# EAGLE design darlington array (EAGLE 9.3.0)
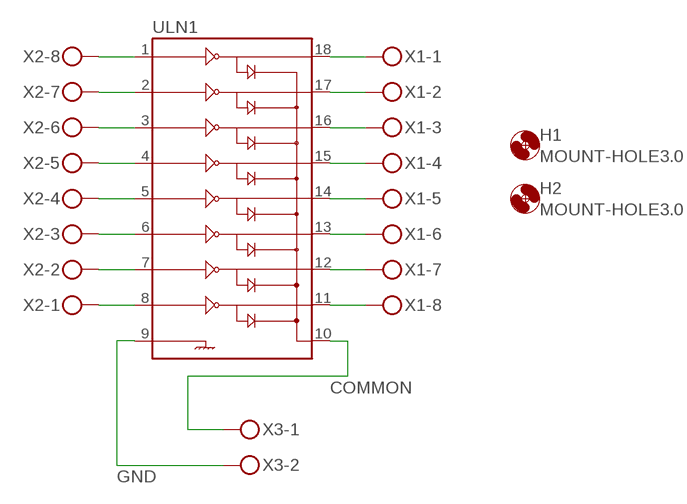
[diagram p0: schematic, sheet 1]

## Parts
H1  MOUNT-HOLE3.0  [3,0]
H2  MOUNT-HOLE3.0  [3,0]
ULN1  ULN2803DIP  [DIL18]
X1  MKDSN1,5/8-5,08  [MKDSN1,5/8-5,08]
X2  MKDSN1,5/8-5,08  [MKDSN1,5/8-5,08]
X3  MKDSN1,5/2-5,08  [MKDSN1,5/2-5,08]

## Nets
COMMON: ULN1.10 X3.1
GND: ULN1.9 X3.2
N$1: ULN1.1 X2.8
N$2: ULN1.2 X2.7
N$3: ULN1.3 X2.6
N$4: ULN1.4 X2.5
N$5: ULN1.5 X2.4
N$6: ULN1.6 X2.3
N$7: ULN1.7 X2.2
N$8: ULN1.8 X2.1
N$9: ULN1.18 X1.1
N$10: ULN1.17 X1.2
N$11: ULN1.16 X1.3
N$12: ULN1.15 X1.4
N$13: ULN1.14 X1.5
N$14: ULN1.13 X1.6
N$15: ULN1.12 X1.7
N$16: ULN1.11 X1.8

## Library data of the parts
H1 H2 = holes:MOUNT-HOLE: MOUNTING HOLE with drill center marker
ULN1 = SparkFun-IC-Special-Function:ULN2803: Darlington Driver(IC-07959, low stock) ULN2803 Darlington array. 500mA max per channel, 8-channel package. Spark Fun Electronics SKU : COM-00312
X1 X2 = con-phoenix-508:MKDSN1,5/8-5,08: MKDSN 1,5/ 8-5,08 Printklemme Nennstrom: 13,5 A Nennspannung: 250 V Rastermaß: 5,08 mm Polzahl: 8 Anschlussart: Schraubanschluss Montage: Löten Anschlussrichtung Leiter/Platine: 0 ° Artikelnummer: 1729186 Source: http://eshop.phoenixcontact.com .. 1729186.pdf
X3 = con-phoenix-508:MKDSN1,5/2-5,08: MKDSN 1,5/ 2-5,08 Printklemme Nennstrom: 13,5 A Nennspannung: 250 V Rastermaß: 5,08 mm Polzahl: 2 Anschlussart: Schraubanschluss Montage: Löten Anschlussrichtung Leiter/Platine: 0 ° Artikelnummer: 1729128 Source: http://eshop.phoenixcontact.com .. 1729128.pdf

## Board
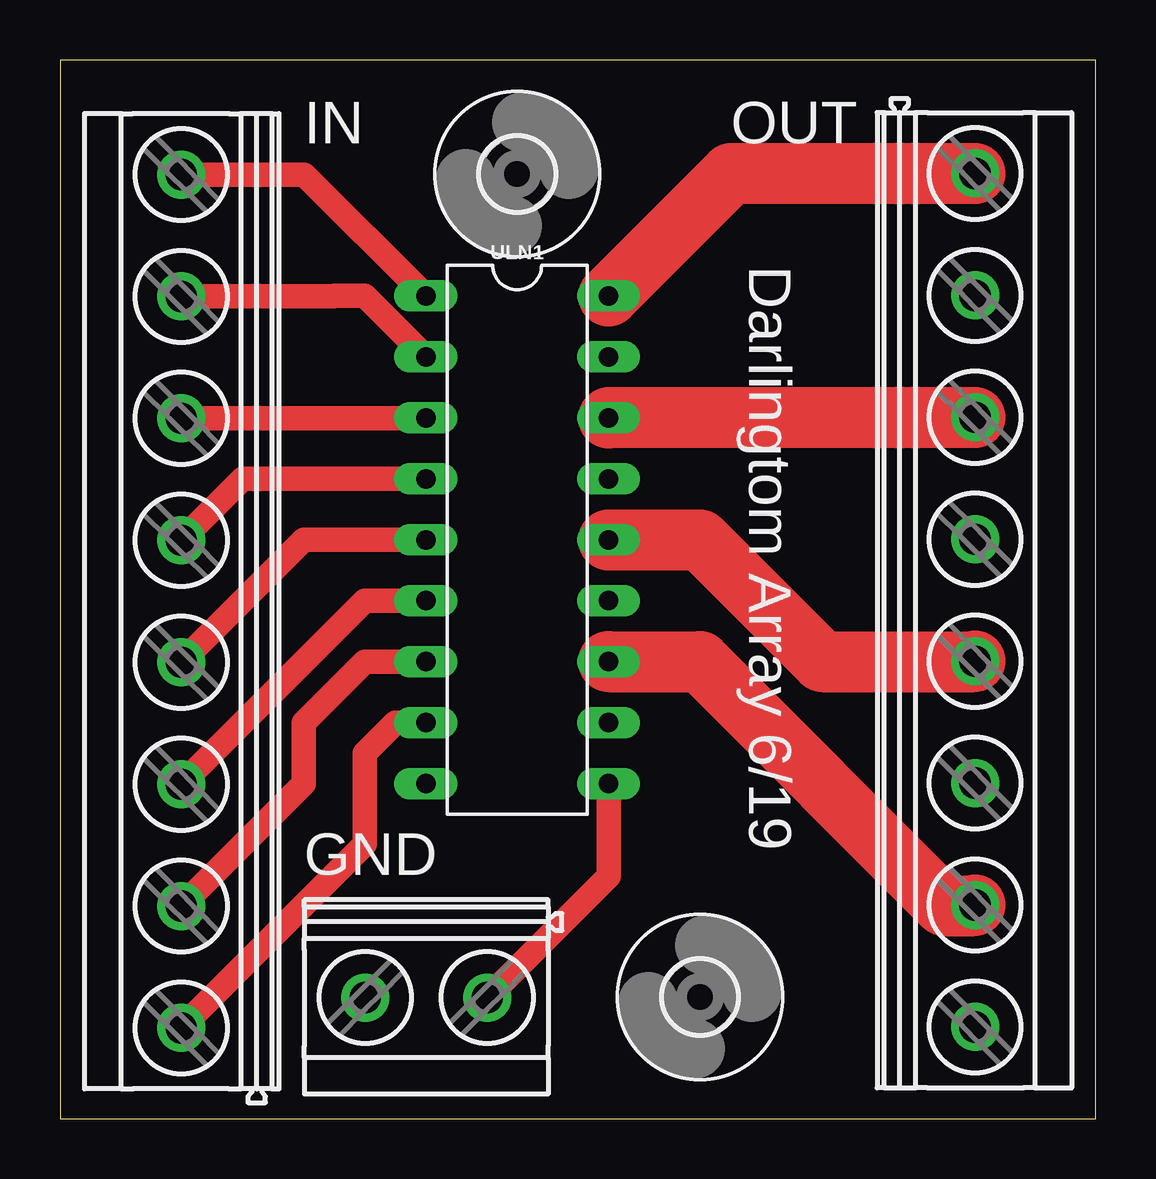
[diagram p1: board, top side]
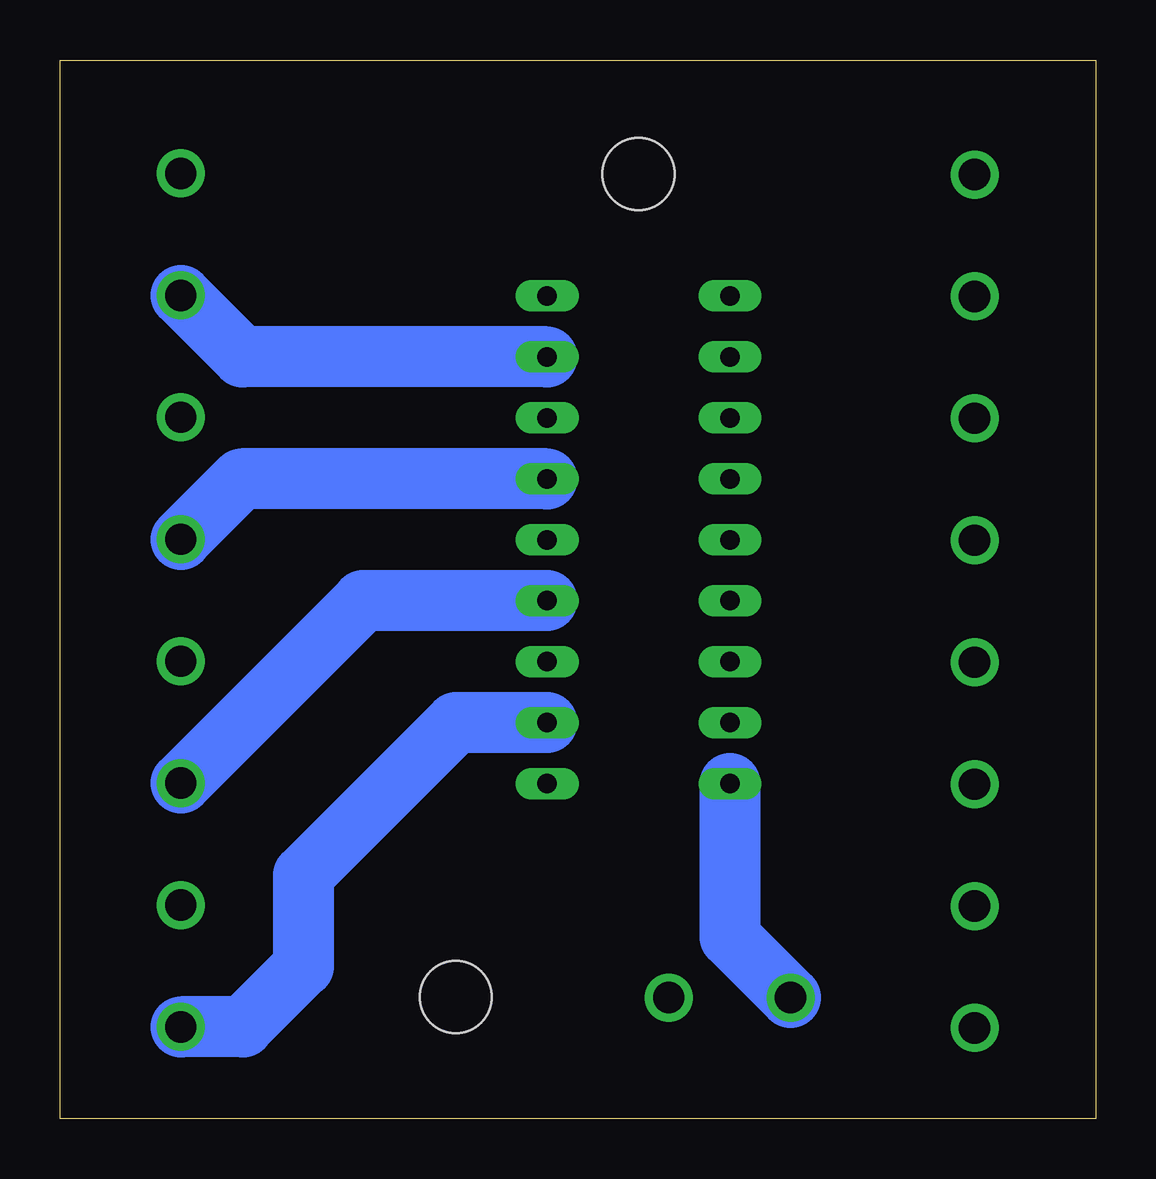
[diagram p2: board, bottom side, seen from below]

Size 43.16 x 44.12 mm. Coordinates in mm from the lower left corner, seen from the top.
Outline: 0,0 43.16,0 43.16,44.12 0,44.12 0,0
Copper layers (1*16): Top 0.035mm / dielectric 1.5mm / Bottom 0.035mm
Design rules "default": minimum track width 6mil, minimum drill 0.35mm, track to track 6mil, track to pad 6mil, pad to pad 6mil, via to via 6mil, smd to smd 6mil, copper to edge 40mil, drill to drill 6mil, minimum pad ring 10mil, minimum via ring 8mil, stop-mask expansion 4mil, vias tented up to drill 0mil, thermal gap 10mil

### Footprints (pad centres in the part's own frame; a part is rotated, then mirrored left to right if it is on the bottom)
3,0 = hole 3: 0,0
DIL18 = drill 0.813 long: 1 -10.16,-3.81; 2 -7.62,-3.81; 3 -5.08,-3.81; 4 -2.54,-3.81; 5 0,-3.81; 6 2.54,-3.81; 7 5.08,-3.81; 8 7.62,-3.81; 9 10.16,-3.81; 10 10.16,3.81; 11 7.62,3.81; 12 5.08,3.81; 13 2.54,3.81; 14 0,3.81; 15 -2.54,3.81; 16 -5.08,3.81; 17 -7.62,3.81; 18 -10.16,3.81
MKDSN1,5/8-5,08 = drill 1.3 pad 2: 1 -17.801,0.025; 2 -12.721,0.025; 3 -7.641,0.025; 4 -2.561,0.025; 5 2.519,0.025; 6 7.599,0.025; 7 12.679,0.025; 8 17.759,0.025
MKDSN1,5/2-5,08 = drill 1.3 pad 2: 1 -2.561,0.025; 2 2.519,0.025

### Placement (x,y rotation side)
H1  19.05,39.37 0 top
H2  26.67,5.08 0 top
ULN1  19.05,24.13 270 top
X1  38.1,21.59 270 top
X2  5.08,21.59 90 top
X3  15.24,5.08 180 top

### Tracks (layer width: path | path; a pad name or v marks a point on that pad's centre or on a via)
COMMON
  Top 1.016: X3.1 22.86,10.11 ULN1.10
GND
  Bottom 2.54: X3.2 15.24,7.57 ULN1.9
N$1
  Top 1.016: X2.8 10.18,39.35 ULN1.1
N$2
  Top 1.016: X2.7 11.41,34.27 11.43,34.29 12.7,34.29 ULN1.2
N$3
  Top 1.016: X2.6 15.22,29.19 ULN1.3
N$4
  Top 1.016: X2.5 7.62,26.67 ULN1.4
N$5
  Top 1.016: X2.4 10.16,24.13 ULN1.5
N$6
  Top 1.016: X2.3 12.7,21.59 ULN1.6
N$7
  Top 1.016: X2.2 10.16,13.97 10.16,16.51 12.7,19.05 ULN1.7
N$8
  Top 1.016: X2.1 12.7,11.43 12.7,15.24 13.97,16.51 ULN1.8
N$9
  Top 2.54: ULN1.18 27.96,39.39 X1.1
N$10
  Bottom 2.54: ULN1.17 35.56,31.75 X1.2
N$11
  Top 2.54: ULN1.16 22.88,29.23 X1.3
N$12
  Bottom 2.54: ULN1.15 35.61,26.67 X1.4
N$13
  Top 2.54: ULN1.14 26.67,24.13 31.75,19.05 38.1,19.05 X1.5
N$14
  Bottom 2.54: ULN1.13 30.53,21.59 X1.6
N$15
  Top 2.54: ULN1.12 26.67,19.05 36.83,8.89 38.1,8.89 X1.7
N$16
  Bottom 2.54: ULN1.11 26.67,16.51 33.02,10.16 33.02,6.35 35.54,3.83 X1.8

### Text on the board
tNames: IN | OUT | Darlingtom Array 6/19 | GND